# Altium schematic sheet [03]-Heating Element.SchDoc: ENTER SHEET TITLE
size B; Engineer: ENTER ENGINEER NAME; Organization: CUAir; Address1: L3, 12a Rodborough Rd; Address2: Frenchs Forest; Address3: NSW; Address4: Australia 2086; Revision: ENTER REVISION NUMBER; CompetitionYear: 2019; CPN: ENTER CPN; PROJECT: ENTER PROJECT NAME
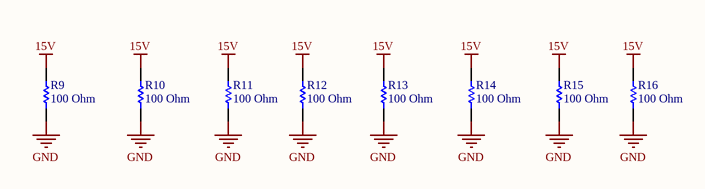
[diagram p0: [03]-Heating Element.SchDoc]

## Parts
R9  100 Ohm  [RESC2010(5025)_N]
R10  100 Ohm  [RESC2010(5025)_N]
R11  100 Ohm  [RESC2010(5025)_N]
R12  100 Ohm  [RESC2010(5025)_N]
R13  100 Ohm  [RESC2010(5025)_N]
R14  100 Ohm  [RESC2010(5025)_N]
R15  100 Ohm  [RESC2010(5025)_N]
R16  100 Ohm  [RESC2010(5025)_N]

## Nets
15V: R9.2 R10.2 R11.2 R12.2 R13.2 R14.2 R15.2 R16.2
GND: R9.1 R10.1 R11.1 R12.1 R13.1 R14.1 R15.1 R16.1

## Notes on the sheet
- Project
- Title
- Size:
- Date:
- B
- Number:
- Revision:
- File:

## Library data of the parts
R9-R16 = CMP-1017-00308-1: 100 Ohms ±1% 2W Chip Resistor 2010 (5025 Metric) Thick Film; MPN: 3502100RFT; Manufacturer: TE Connectivity Passive Product; Case-EIA: 2010; Value: 100 Ohm